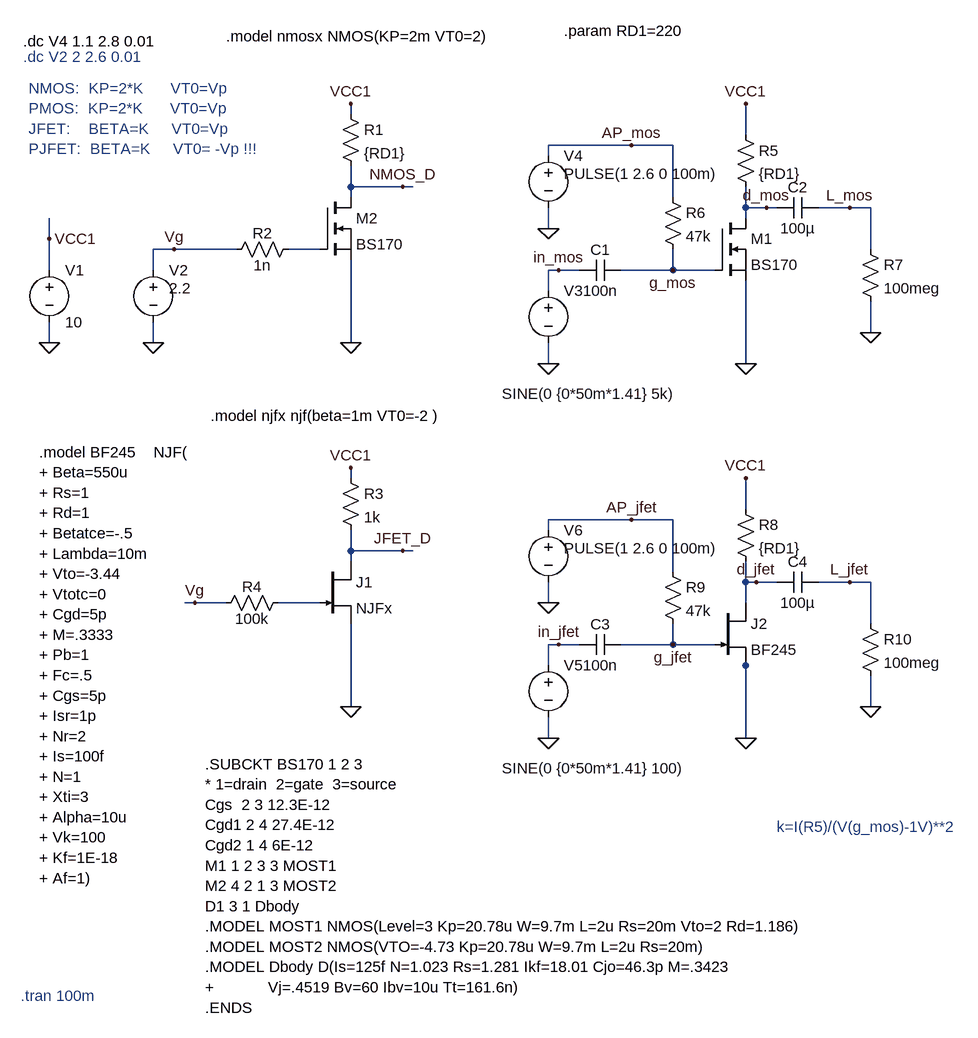
[diagram p0: schematic BS170_BF245_Kennwerte_EIT.asc]
BS170_BF245_Kennwerte_EIT.asc, the LTspice schematic file:
Version 4
SHEET 1 2352 1996
WIRE 192 -32 192 -48
WIRE 800 0 800 -48
WIRE 624 16 496 16
WIRE 688 16 624 16
WIRE 496 32 496 16
WIRE 192 80 192 48
WIRE 272 80 192 80
WIRE 288 80 272 80
WIRE 192 96 192 80
WIRE 688 96 688 16
WIRE 800 112 800 80
WIRE 832 112 800 112
WIRE 848 112 832 112
WIRE 960 112 912 112
WIRE 992 112 960 112
WIRE 800 128 800 112
WIRE 496 144 496 112
WIRE -272 160 -272 128
WIRE -80 176 -112 176
WIRE 16 176 -80 176
WIRE 144 176 96 176
WIRE 992 176 992 112
WIRE -272 208 -272 160
WIRE -112 208 -112 176
WIRE 512 208 496 208
WIRE 544 208 512 208
WIRE 688 208 688 176
WIRE 688 208 608 208
WIRE 752 208 688 208
WIRE 496 240 496 208
WIRE 992 304 992 256
WIRE -272 320 -272 288
WIRE -112 320 -112 288
WIRE 192 320 192 192
WIRE 496 352 496 320
WIRE 800 352 800 224
WIRE 192 528 192 512
WIRE 800 576 800 528
WIRE 624 592 496 592
WIRE 688 592 624 592
WIRE 496 608 496 592
WIRE 192 640 192 608
WIRE 272 640 192 640
WIRE 288 640 272 640
WIRE 192 656 192 640
WIRE 688 672 688 592
WIRE 800 688 800 656
WIRE 816 688 800 688
WIRE 848 688 816 688
WIRE 960 688 912 688
WIRE 992 688 960 688
WIRE -48 720 -64 720
WIRE 0 720 -48 720
WIRE 144 720 80 720
WIRE 496 720 496 688
WIRE 800 720 800 688
WIRE 992 752 992 688
WIRE 512 784 496 784
WIRE 544 784 512 784
WIRE 688 784 688 752
WIRE 688 784 608 784
WIRE 752 784 688 784
WIRE 496 816 496 784
WIRE 800 816 800 800
WIRE 192 880 192 752
WIRE 992 880 992 832
WIRE 496 928 496 896
WIRE 800 928 800 816
FLAG 192 320 0
FLAG -272 320 0
FLAG -112 320 0
FLAG -272 160 VCC1
FLAG 192 -48 VCC1
FLAG 192 880 0
FLAG 192 512 VCC1
FLAG -80 176 Vg
FLAG -48 720 Vg
FLAG 272 640 JFET_D
FLAG 272 80 NMOS_D
FLAG 800 352 0
FLAG 496 352 0
FLAG 800 -48 VCC1
FLAG 496 144 0
FLAG 624 16 AP_mos
FLAG 688 208 g_mos
FLAG 960 112 L_mos
FLAG 512 208 in_mos
FLAG 992 304 0
FLAG 800 928 0
FLAG 496 928 0
FLAG 800 528 VCC1
FLAG 496 720 0
FLAG 624 592 AP_jfet
FLAG 688 784 g_jfet
FLAG 960 688 L_jfet
FLAG 512 784 in_jfet
FLAG 992 880 0
FLAG 832 112 d_mos
FLAG 816 688 d_jfet
SYMBOL voltage -272 192 R0
WINDOW 123 0 0 Left 2
WINDOW 39 0 0 Left 2
SYMATTR InstName V1
SYMATTR Value 10
SYMBOL res 176 -48 R0
SYMATTR InstName R1
SYMATTR Value {RD1}
SYMBOL voltage -112 192 R0
WINDOW 123 0 0 Left 2
WINDOW 39 0 0 Left 2
WINDOW 3 24 44 Left 2
SYMATTR Value 2.2
SYMATTR InstName V2
SYMBOL res 0 192 R270
WINDOW 0 25 56 VTop 2
WINDOW 3 7 56 VBottom 2
SYMATTR InstName R2
SYMATTR Value 1n
SYMBOL nmos 144 96 R0
SYMATTR InstName M2
SYMATTR Value BS170
SYMATTR Prefix X
SYMBOL njf 144 656 R0
SYMATTR InstName J1
SYMATTR Value NJFx
SYMBOL res 176 512 R0
SYMATTR InstName R3
SYMATTR Value 1k
SYMBOL res -16 736 R270
WINDOW 0 25 56 VTop 2
WINDOW 3 7 56 VBottom 2
SYMATTR InstName R4
SYMATTR Value 100k
SYMBOL res 784 -16 R0
SYMATTR InstName R5
SYMATTR Value {RD1}
SYMBOL voltage 496 224 R0
WINDOW 123 0 0 Left 2
WINDOW 39 0 0 Left 2
WINDOW 3 -71 174 Left 2
SYMATTR Value SINE(0 {0*50m*1.41} 5k)
SYMATTR InstName V3
SYMBOL res 672 80 R0
SYMATTR InstName R6
SYMATTR Value 47k
SYMBOL cap 544 224 R270
WINDOW 0 32 32 VTop 2
WINDOW 3 0 32 VBottom 2
SYMATTR InstName C1
SYMATTR Value 100n
SYMBOL voltage 496 16 R0
WINDOW 123 0 0 Left 2
WINDOW 39 0 0 Left 2
WINDOW 3 24 44 Left 2
SYMATTR Value PULSE(1 2.6 0 100m)
SYMATTR InstName V4
SYMBOL cap 848 128 R270
WINDOW 0 32 32 VTop 2
WINDOW 3 0 32 VBottom 2
SYMATTR InstName C2
SYMATTR Value 100µ
SYMBOL res 976 160 R0
SYMATTR InstName R7
SYMATTR Value 100meg
SYMBOL nmos 752 128 R0
SYMATTR InstName M1
SYMATTR Value BS170
SYMATTR Prefix X
SYMBOL res 784 560 R0
SYMATTR InstName R8
SYMATTR Value {RD1}
SYMBOL res 672 656 R0
SYMATTR InstName R9
SYMATTR Value 47k
SYMBOL cap 544 800 R270
WINDOW 0 32 32 VTop 2
WINDOW 3 0 32 VBottom 2
SYMATTR InstName C3
SYMATTR Value 100n
SYMBOL cap 848 704 R270
WINDOW 0 32 32 VTop 2
WINDOW 3 0 32 VBottom 2
SYMATTR InstName C4
SYMATTR Value 100µ
SYMBOL res 976 736 R0
SYMATTR InstName R10
SYMATTR Value 100meg
SYMBOL voltage 496 800 R0
WINDOW 123 0 0 Left 2
WINDOW 39 0 0 Left 2
WINDOW 3 -71 174 Left 2
SYMATTR Value SINE(0 {0*50m*1.41} 100)
SYMATTR InstName V5
SYMBOL voltage 496 592 R0
WINDOW 123 0 0 Left 2
WINDOW 39 0 0 Left 2
WINDOW 3 24 44 Left 2
SYMATTR Value PULSE(1 2.6 0 100m)
SYMATTR InstName V6
SYMBOL njf 752 720 R0
SYMATTR InstName J2
SYMATTR Value BF245
TEXT -312 -144 Left 2 !.dc V4 1.1 2.8 0.01
TEXT 0 -152 Left 2 !.model nmosx NMOS(KP=2m VT0=2)
TEXT -24 432 Left 2 !.model njfx njf(beta=1m VT0=-2 )
TEXT -304 -72 Left 2 ;NMOS:  KP=2*K      VT0=Vp\nPMOS:  KP=2*K      VT0=Vp\nJFET:    BETA=K     VT0=Vp\nPJFET:  BETA=K     VT0= -Vp !!!
TEXT 520 -160 Left 2 !.param RD1=220
TEXT -32 968 Left 2 !.SUBCKT BS170 1 2 3\n* 1=drain  2=gate  3=source\nCgs  2 3 12.3E-12\nCgd1 2 4 27.4E-12\nCgd2 1 4 6E-12\nM1 1 2 3 3 MOST1\nM2 4 2 1 3 MOST2\nD1 3 1 Dbody\n.MODEL MOST1 NMOS(Level=3 Kp=20.78u W=9.7m L=2u Rs=20m Vto=2 Rd=1.186)\n.MODEL MOST2 NMOS(VTO=-4.73 Kp=20.78u W=9.7m L=2u Rs=20m)\n.MODEL Dbody D(Is=125f N=1.023 Rs=1.281 Ikf=18.01 Cjo=46.3p M=.3423\n+            Vj=.4519 Bv=60 Ibv=10u Tt=161.6n)\n.ENDS
TEXT -288 488 Left 2 !.model BF245    NJF(\n+ Beta=550u \n+ Rs=1 \n+ Rd=1 \n+ Betatce=-.5 \n+ Lambda=10m \n+ Vto=-3.44\n+ Vtotc=0 \n+ Cgd=5p \n+ M=.3333 \n+ Pb=1 \n+ Fc=.5 \n+ Cgs=5p \n+ Isr=1p \n+ Nr=2 \n+ Is=100f\n+ N=1 \n+ Xti=3 \n+ Alpha=10u \n+ Vk=100 \n+ Kf=1E-18 \n+ Af=1)
TEXT -312 -120 Left 2 ;.dc V2 2 2.6 0.01
TEXT 848 1064 Left 2 ;k=I(R5)/(V(g_mos)-1V)**2
TEXT -316 1324 Left 2 ;.tran 100m

The netlist it stands for:
* BS170_BF245_Kennwerte_EIT.asc
V1 VCC1 0 10
R1 VCC1 NMOS_D {RD1}
V2 Vg 0 2.2
R2 Vg N001 1n
XM2 NMOS_D N001 0 BS170  ; pins D G S
J1 JFET_D N002 0 NJFx
R3 VCC1 JFET_D 1k
R4 Vg N002 100k
R5 VCC1 d_mos {RD1}
V3 in_mos 0 SINE(0 {0*50m*1.41} 5k)
R6 AP_mos g_mos 47k
C1 in_mos g_mos 100n
V4 AP_mos 0 PULSE(1 2.6 0 100m)
C2 d_mos L_mos 100µ
R7 L_mos 0 100meg
XM1 d_mos g_mos 0 BS170  ; pins D G S
R8 VCC1 d_jfet {RD1}
R9 AP_jfet g_jfet 47k
C3 in_jfet g_jfet 100n
C4 d_jfet L_jfet 100µ
R10 L_jfet 0 100meg
V5 in_jfet 0 SINE(0 {0*50m*1.41} 100)
V6 AP_jfet 0 PULSE(1 2.6 0 100m)
J2 d_jfet g_jfet 0 BF245
.model NJF NJF
.model PJF PJF
.lib standard.jft
.dc V4 1.1 2.8 0.01
.model nmosx NMOS(KP=2m VT0=2)
.model njfx njf(beta=1m VT0=-2 )
* NMOS:  KP=2*K      VT0=Vp
* PMOS:  KP=2*K      VT0=Vp
* JFET:    BETA=K     VT0=Vp
* PJFET:  BETA=K     VT0= -Vp !!!
.param RD1=220
.SUBCKT BS170 1 2 3
* 1=drain  2=gate  3=source
Cgs  2 3 12.3E-12
Cgd1 2 4 27.4E-12
Cgd2 1 4 6E-12
M1 1 2 3 3 MOST1
M2 4 2 1 3 MOST2
D1 3 1 Dbody
.MODEL MOST1 NMOS(Level=3 Kp=20.78u W=9.7m L=2u Rs=20m Vto=2 Rd=1.186)
.MODEL MOST2 NMOS(VTO=-4.73 Kp=20.78u W=9.7m L=2u Rs=20m)
.MODEL Dbody D(Is=125f N=1.023 Rs=1.281 Ikf=18.01 Cjo=46.3p M=.3423
+            Vj=.4519 Bv=60 Ibv=10u Tt=161.6n)
.ENDS
.model BF245    NJF(
+ Beta=550u
+ Rs=1
+ Rd=1
+ Betatce=-.5
+ Lambda=10m
+ Vto=-3.44
+ Vtotc=0
+ Cgd=5p
+ M=.3333
+ Pb=1
+ Fc=.5
+ Cgs=5p
+ Isr=1p
+ Nr=2
+ Is=100f
+ N=1
+ Xti=3
+ Alpha=10u
+ Vk=100
+ Kf=1E-18
+ Af=1)
* .dc V2 2 2.6 0.01
* k=I(R5)/(V(g_mos)-1V)**2
* .tran 100m
.backanno
.end